# EAGLE design Aula 1 - Oscilador Astável (EAGLE 6.2)
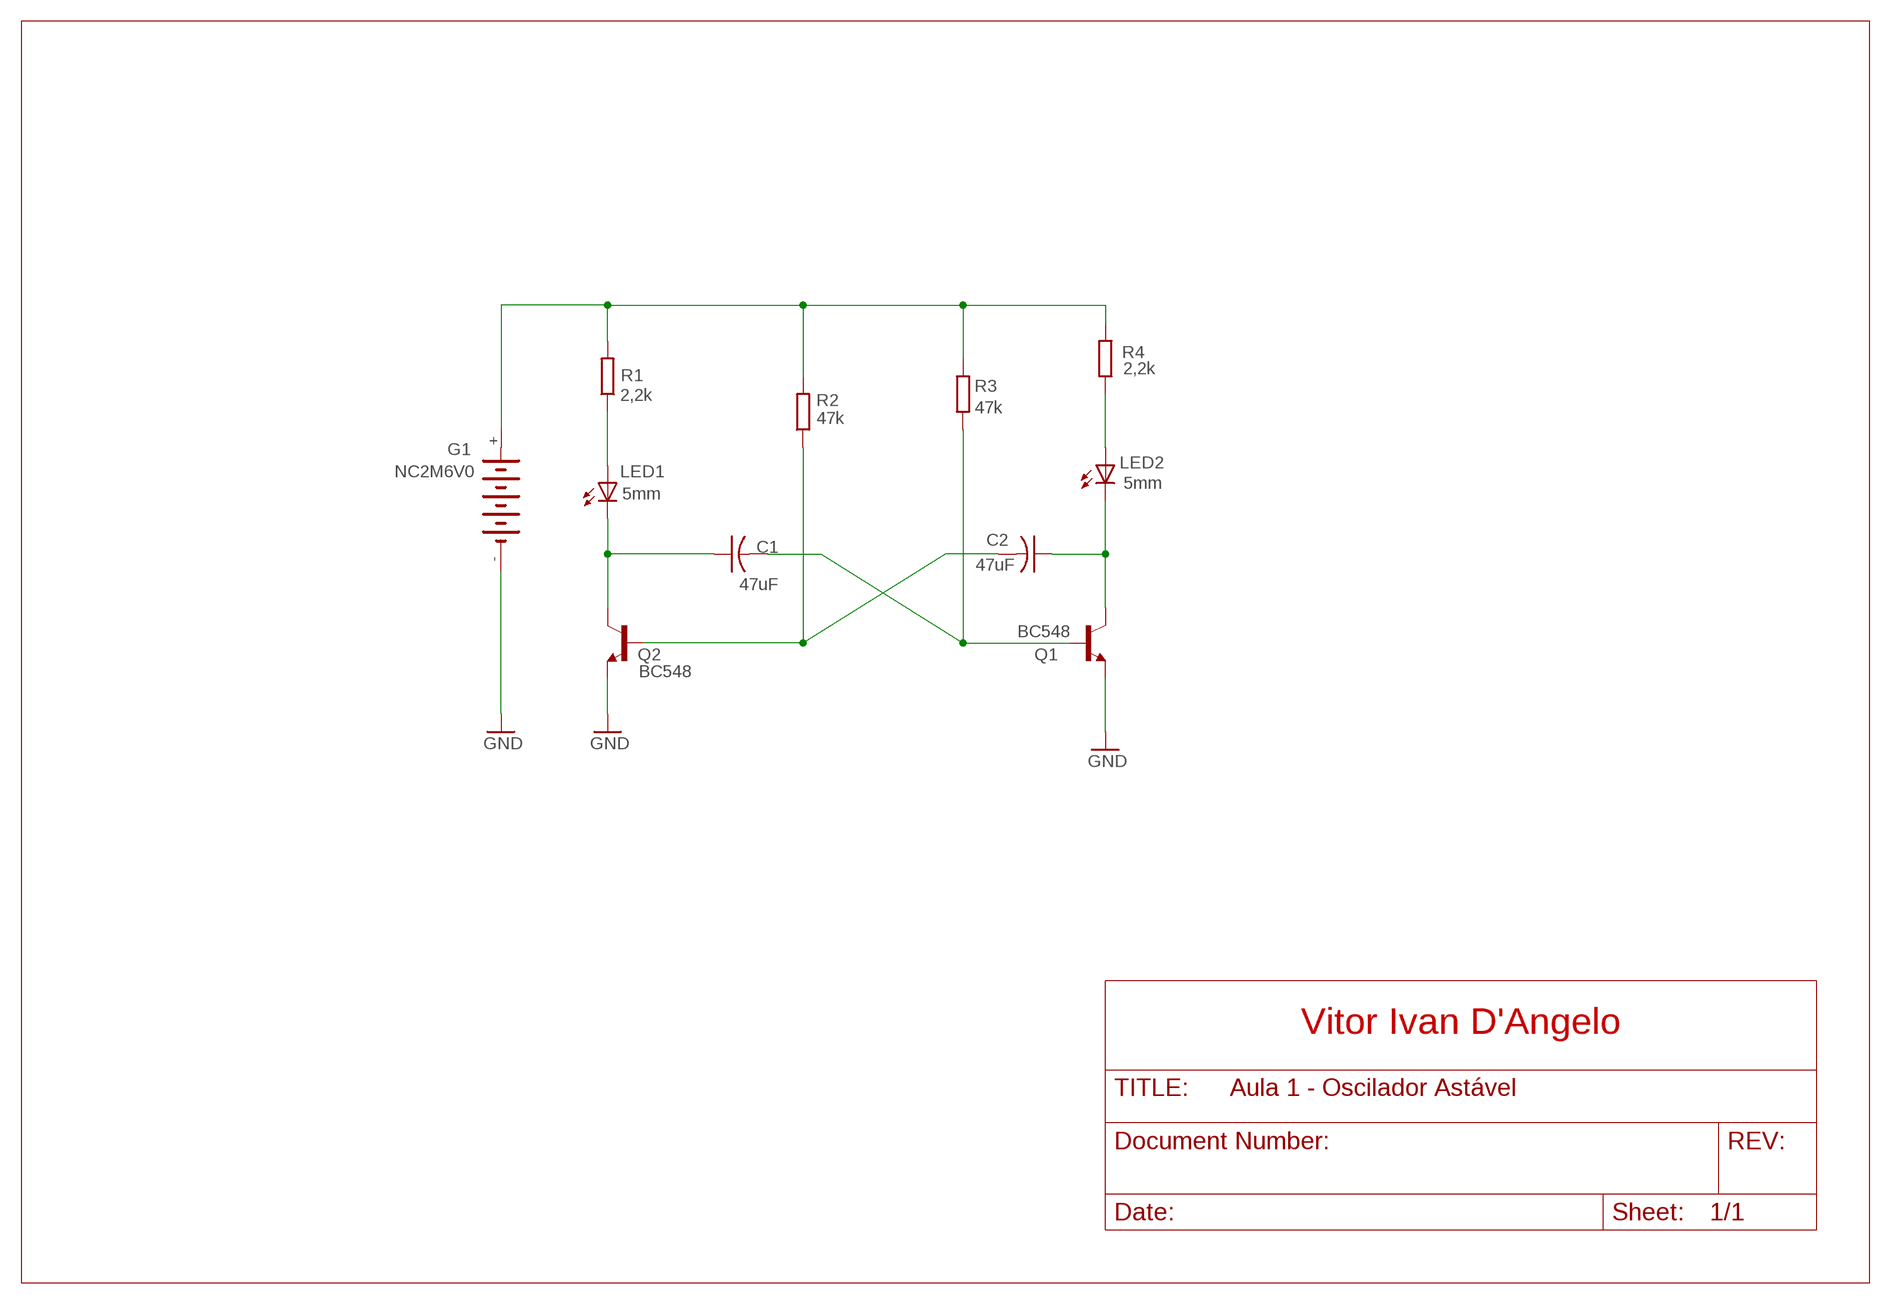
[diagram p0: schematic, sheet 1]

## Parts
C1  47uF  C-US025-025X050  [C025-025X050]
C2  47uF  C-US025-025X050  [C025-025X050]
G1  NC2M6V0  [NC2M]
LED1  5mm  LED5MM  [LED5MM]
LED2  5mm  LED5MM  [LED5MM]
Q1  BC548  [TO92-EBC]
Q2  BC548  [TO92-EBC]
R1  2,2k  R-EU_0204/5  [0204/5]
R2  47k  R-EU_0204/5  [0204/5]
R3  47k  R-EU_0204/5  [0204/5]
R4  2,2k  R-EU_0204/5  [0204/5]

## Nets
GND: G1.- Q1.E Q2.E
N$1: LED1.A R1.1
N$2: G1.+ R1.2 R2.2 R3.2 R4.2
N$3: LED2.A R4.1
N$4: C1.1 LED1.K(C) Q2.C
N$5: C2.1 LED2.K(C) Q1.C
N$6: C2.2 Q2.B R2.1
N$7: C1.2 Q1.B R3.1
Unconnected: G1.+@1(+)

## Notes on the sheet
- Vitor Ivan D'Angelo

## Library data of the parts
C1 C2 = rcl:C-US: CAPACITOR, American symbol
G1 = battery:NC2M6V0: NC ACCU Sonnenschein Memo NC-M 6.0V, grid 25.4mm
LED1 LED2 = led:LED: LED OSRAM: - CHIPLED LG R971, LG N971, LY N971, LG Q971, LY Q971, LO R971, LY R971 LH N974, LH R974 LS Q976, LO Q976, LY Q976 LO Q996 - Hyper CHIPLED LW Q18S LB Q993, LB Q99A, LB R99A - SideLED LS A670, LO A670, LY A670, LG A670, LP A670 LB A673, LV A673, LT A673, LW A673 LH A674 LY A675 LS A676, LA A676, LO A676, LY A676, LW A676 LS A679, LY A679, LG A679 - Hyper Micro SIDELED® LS Y876, LA Y876, LO Y876, LY Y876 LT Y87S - SmartLED LW L88C, LW L88S LB L89C, LB L89S, LG L890 LS L89K, LO L89K, LY L89K LS L896, LA L896, LO L896, LY L896 - TOPLED LS T670, LO T670, LY T670, LG T670, LP T670 LSG T670, LSP T670, LSY T670, LOP T670, LYG T670 LG T671, LOG T671, LSG T671 LB T673, LV T673, LT T673, LW T673 LH T674 LS T676, LA T676, LO T676, LY T676, LB T676, LH T676, LSB T676, LW T676 LB T67C, LV T67C, LT T67C, LS T67K, LO T67K, LY T67K, LW E67C LS E67B, LA E67B, LO E67B, LY E67B, LB E67C, LV E67C, LT E67C LW T67C LS T679, LY T679, LG T679 LS T770, LO T770, LY T770, LG T770, LP T770 LB T773, LV T773, LT T773, LW T773 LH T774 LS E675, LA E675, LY E675, LS T675 LS T776, LA T776, LO T776, LY T776, LB T776 LHGB T686 LT T68C, LB T68C - Hyper Mini TOPLED® LB M676 - Mini TOPLED Santana® LG M470 LS M47K, LO M47K, LY M47K Source: http://www.osram.convergy.de LUXEON: - LUMILED® LXK2-PW12-R00, LXK2-PW12-S00, LXK2-PW14-U00, LXK2-PW14-V00 LXK2-PM12-R00, LXK2-PM12-S00, LXK2-PM14-U00 LXK2-PE12-Q00, LXK2-PE12-R00, LXK2-PE12-S00, LXK2-PE14-T00, LXK2-PE14-U00 LXK2-PB12-K00, LXK2-PB12-L00, LXK2-PB12-M00, LXK2-PB14-N00, LXK2-PB14-P00, LXK2-PB14-Q00 LXK2-PR12-L00, LXK2-PR12-M00, LXK2-PR14-Q00, LXK2-PR14-R00 LXK2-PD12-Q00, LXK2-PD12-R00, LXK2-PD12-S00 LXK2-PH12-R00, LXK2-PH12-S00 LXK2-PL12-P00, LXK2-PL12-Q00, LXK2-PL12-R00 Source: www.luxeon.com KINGBRIGHT: KA-3528ASYC Source: www.kingbright.com
Q1 Q2 = transistor-npn:BC548*: NPN Transistor
R1-R4 = rcl:R-EU_: RESISTOR, European symbol

## Board
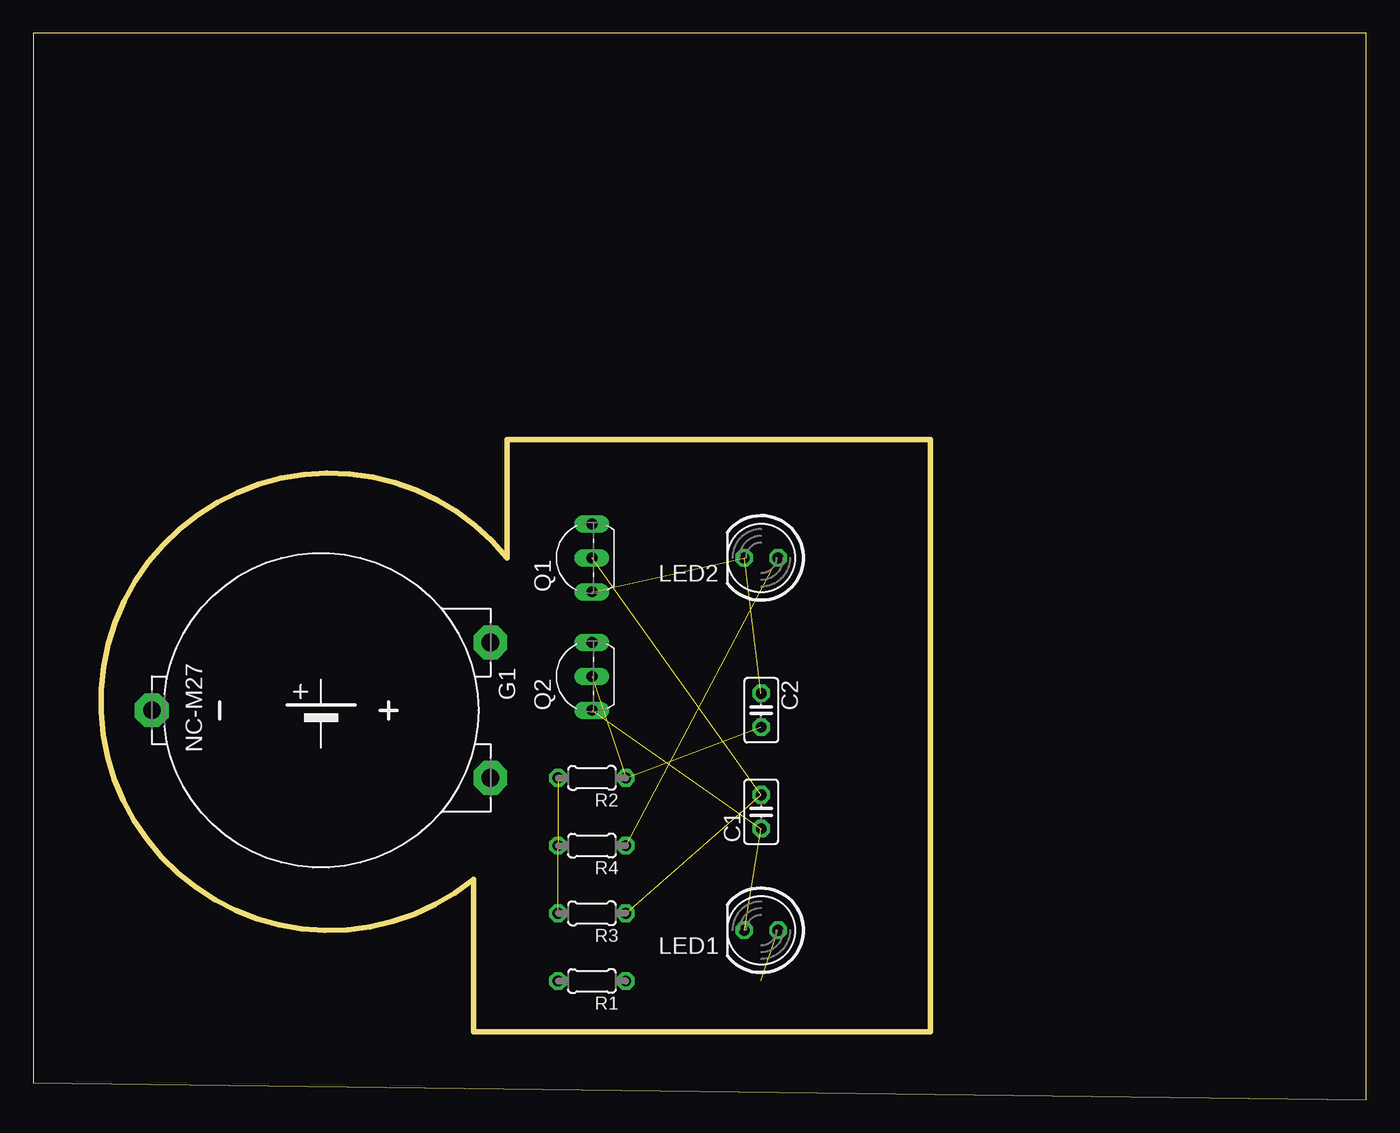
[diagram p1: board, top side]
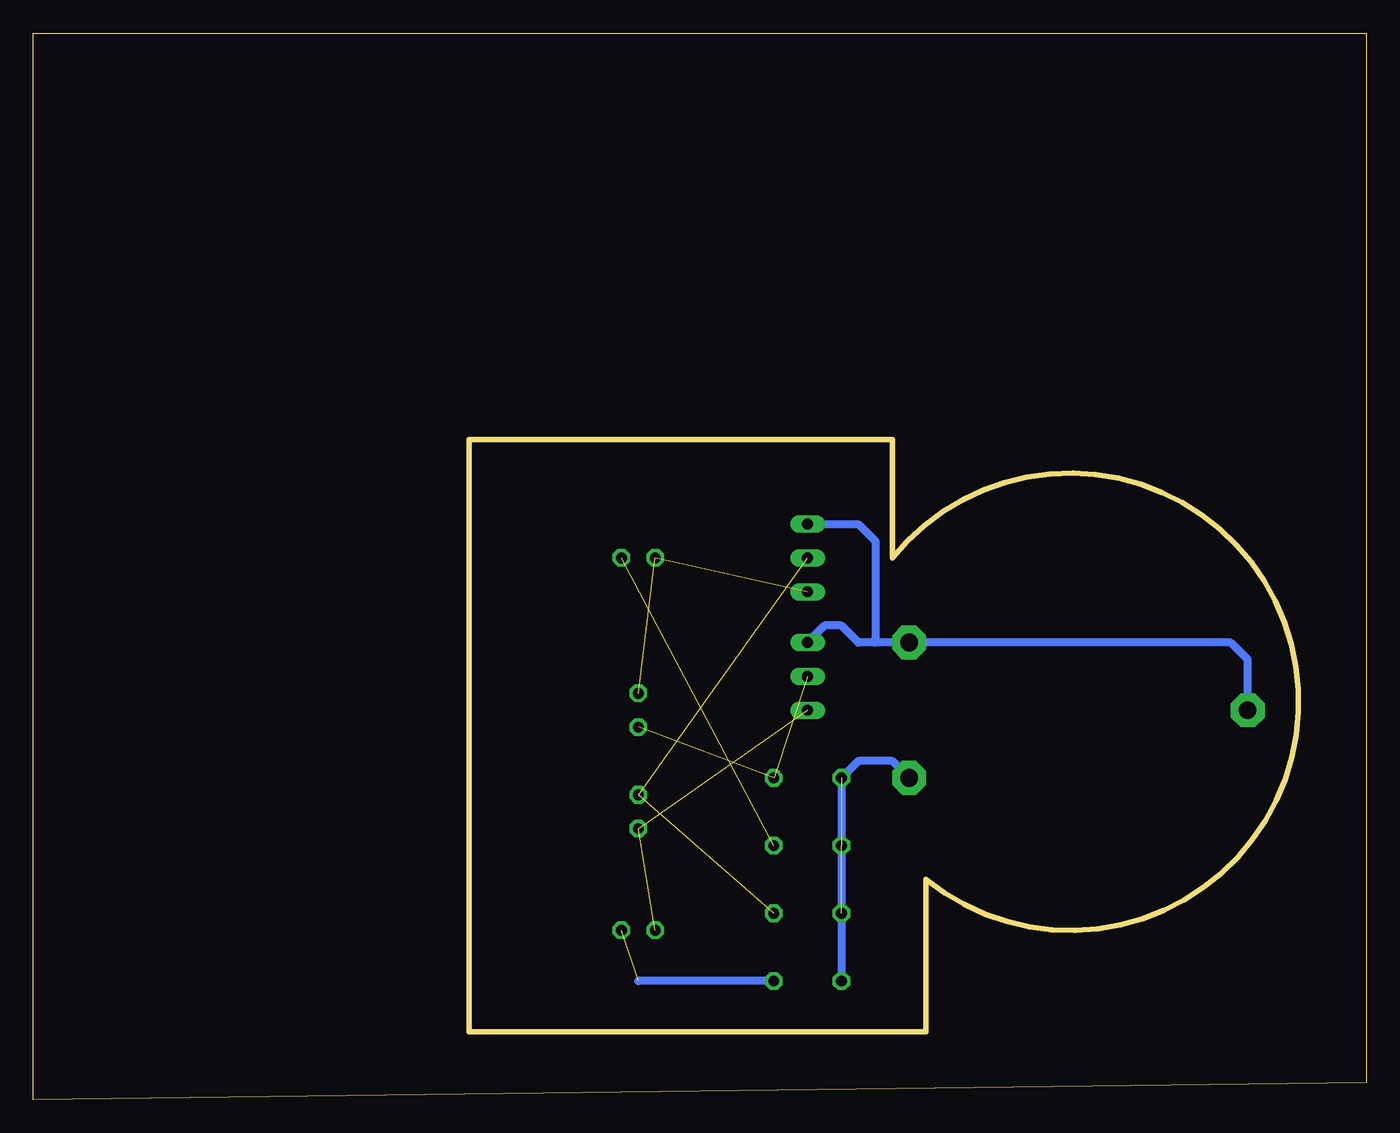
[diagram p2: board, bottom side, seen from below]

Size 100 x 80 mm. Coordinates in mm from the lower left corner, seen from the top.
Outline: 0,1.27 100,0 100,80 0,80 0,1.27
Outline: 35.56,40.64 arc270 33.02,16.51 33.02,5.08 67.31,5.08 67.31,49.53 35.56,49.53 35.56,40.64
Copper layers (1*16): Top 0.035mm / dielectric 1.5mm / Bottom 0.035mm
Design rules: minimum track width 10mil, minimum drill 24mil, track to track 8mil, track to pad 8mil, pad to pad 8mil, via to via 8mil, smd to smd 8mil, copper to edge 40mil, drill to drill 8mil, minimum pad ring 10mil, minimum via ring 8mil, stop-mask expansion 4mil, vias tented up to drill 0mil, thermal gap 10mil

### Footprints (pad centres in the part's own frame; a part is rotated, then mirrored left to right if it is on the bottom)
C025-025X050 = drill 0.813 octagon: 1 -1.27,0; 2 1.27,0
NC2M = drill 1.321 pad 2.54 octagon: + 5.08,12.7; +@1 -5.08,12.7; - 0,-12.7
LED5MM = drill 0.813 octagon: A -1.27,0; K 1.27,0
TO92-EBC = drill 0.813 long: B 0,-1.27; C -2.54,-1.27; E 2.54,-1.27
0204/5 = drill 0.813 octagon: 1 -2.54,0; 2 2.54,0

### Placement (x,y rotation side)
C1  54.61,21.59 90 top
C2  54.61,29.21 270 top
G1  21.59,29.21 270 top
LED1  54.61,12.7 180 top
LED2  54.61,40.64 180 top
Q1  40.64,40.64 90 top
Q2  40.64,31.75 90 top
R1  41.91,8.89 180 top
R2  41.91,24.13 180 top
R3  41.91,13.97 180 top
R4  41.91,19.05 180 top

### Tracks (layer width: path | path; a pad name or v marks a point on that pad's centre or on a via)
GND
  Bottom 0.61: G1.- 8.89,33.02 10.16,34.29 36.83,34.29 | Q1.E 38.1,43.18 36.83,41.91 36.83,34.29 | 36.83,34.29 38.1,34.29 39.37,35.56 40.64,35.56 Q2.E
N$1  (1 unrouted)
  Bottom 0.61: R1.1 54.61,8.89
N$2  (2 unrouted)
  Bottom 0.61: G1.+ 35.56,25.4 38.1,25.4 R2.2 R1.2
N$3  (1 unrouted)
N$4  (2 unrouted)
N$5  (2 unrouted)
N$6  (2 unrouted)
N$7  (2 unrouted)